# EAGLE schematic Carloop-v2.0 (EAGLE 7.5.0)
DATABASE: /home/monkbroc/Electronics/eagle/PARTSDB.tsv
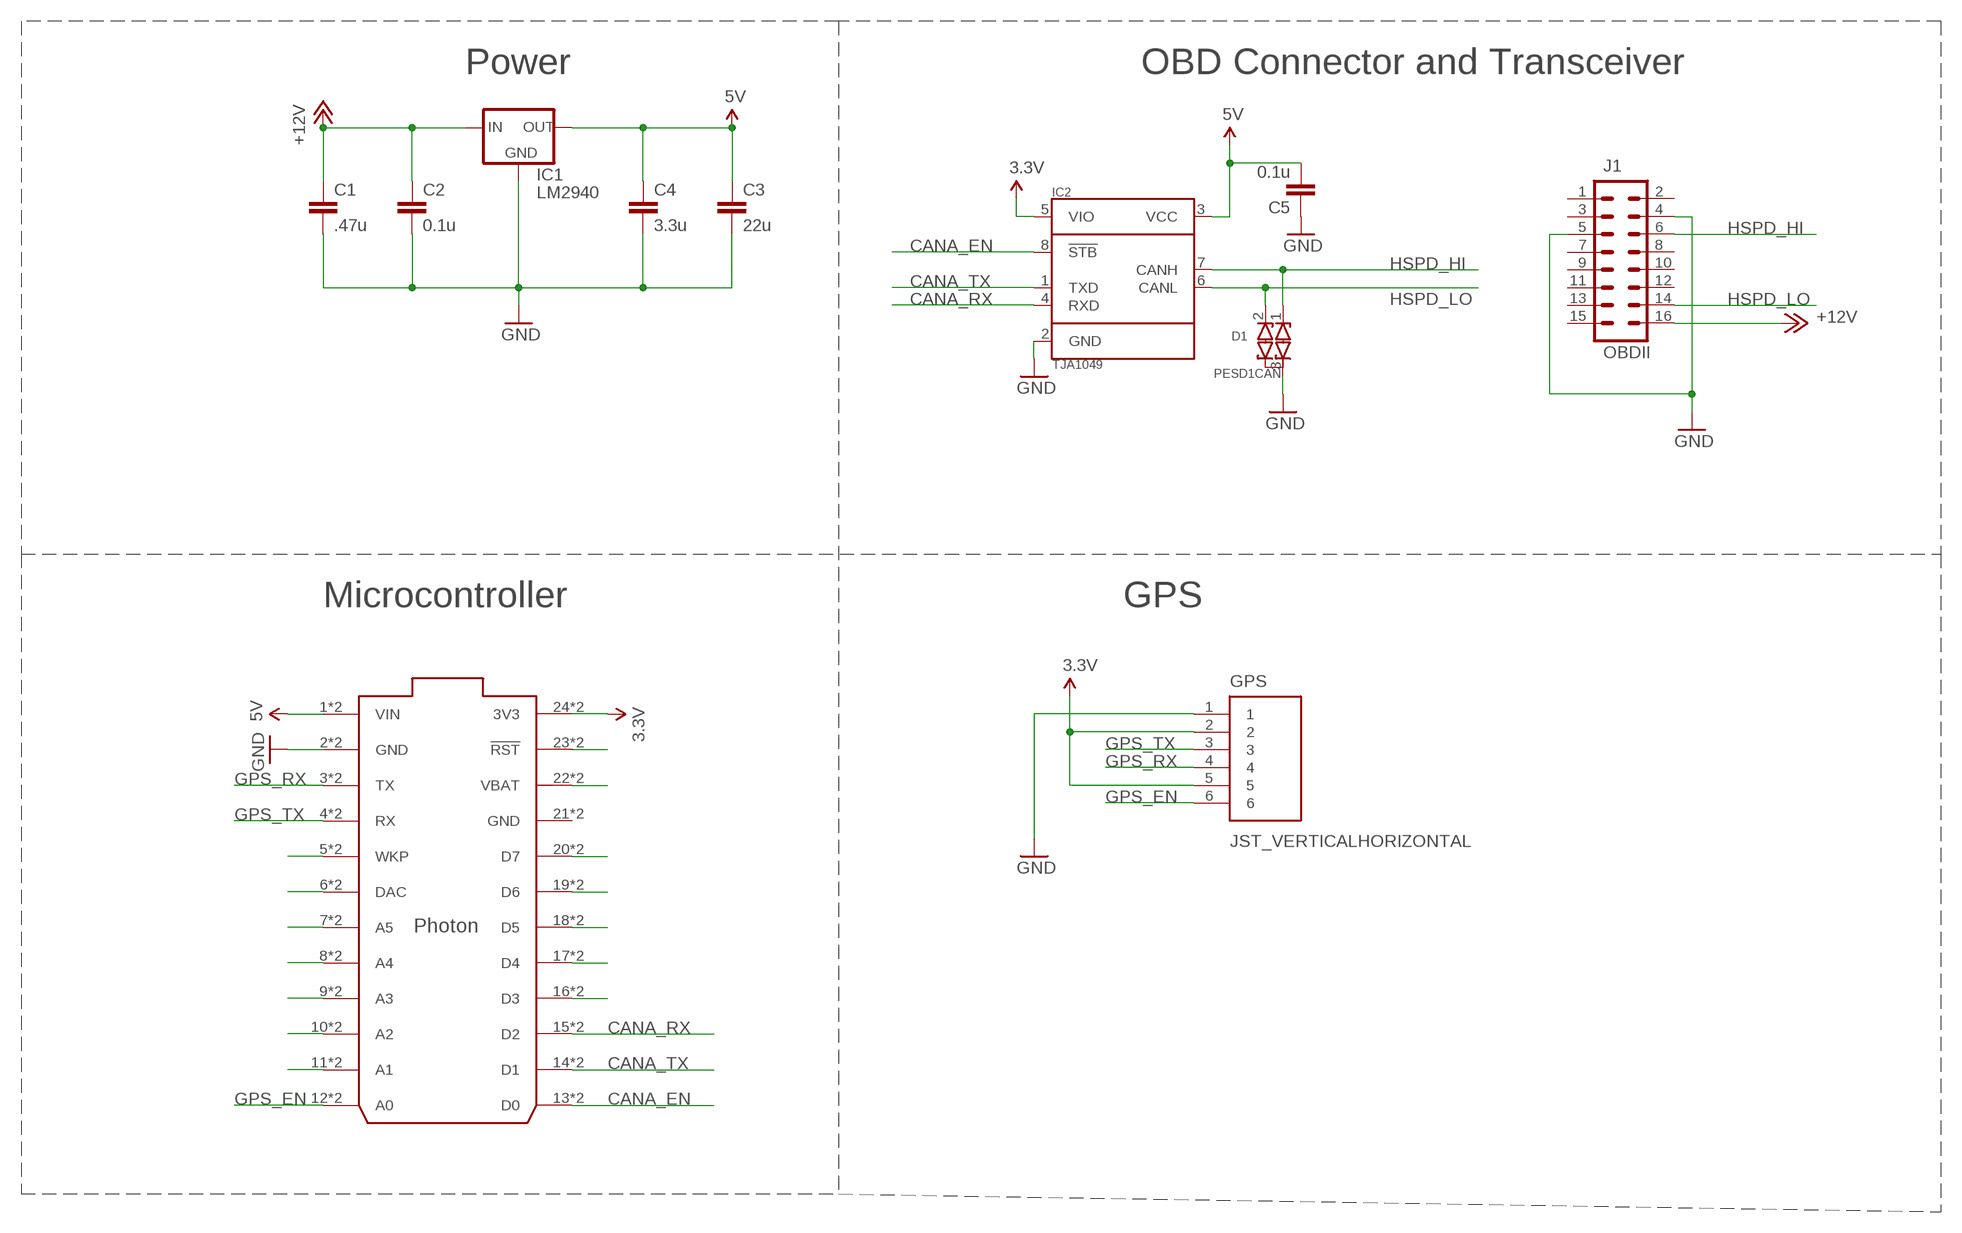
[diagram p0: schematic, sheet 1]

## Parts
C1  .47u  C-EUC0805  [C0805]
C2  0.1u  C-EUC0805  [C0805]
C3  22u  C-EUC0805  [C0805]
C4  3.3u  C-EUC0805  [C0805]
C5  0.1u  C-EUC0805  [C0805]
CORE  PHOTONWITH_EXTERNAL_HEADERS  [PHOTON_STACKABLE_EXTERNAL]
D1  PESD1CAN  DIODE_ESD_DUAL-SOT-23  [SOT23]
GPS  JST_VERTICALHORIZONTAL  [JST-6-SMD-HOR-1.0MM]
IC1  LM2940  [SOT223]
IC2  TJA1049  [SO8]
J1  OBDII  M08X2STRAIGHT  [OBDII-STRAIGHT]

## Nets
3.3V: CORE.24(3V3) CORE.@24(3V3) GPS.2 GPS.5 IC2.5(VIO)
5V: C3.1 C4.1 C5.2 CORE.1(VIN) CORE.@1(VIN) IC1.3(OUT) IC2.3(VCC)
+12V: C1.1 C2.1 IC1.1(IN) J1.16
CANA_EN: CORE.13(D0) CORE.@13(D0) IC2.8(!STB)
CANA_RX: CORE.15(D2) CORE.@15(D2) IC2.4(RXD)
CANA_TX: CORE.14(D1) CORE.@14(D1) IC2.1(TXD)
GND: C1.2 C2.2 C3.2 C4.2 C5.1 CORE.2(GND) CORE.@2(GND) D1.3(COM) GPS.1 IC1.2(GND) IC1.4(GND) IC2.2(GND) J1.4 J1.5
GPS_EN: CORE.12(A0) CORE.@12(A0) GPS.6
GPS_RX: CORE.3(TX) CORE.@3(TX) GPS.4
GPS_TX: CORE.4(RX) CORE.@4(RX) GPS.3
HSPD_HI: D1.1(C1) IC2.7(CANH) J1.6
HSPD_LO: D1.2(C2) IC2.6(CANL) J1.14
N$10: CORE.23(!RST) CORE.@23(!RST)
N$11: CORE.22(VBAT) CORE.@22(VBAT)
N$12: CORE.20(D7) CORE.@20(D7)
N$13: CORE.19(D6) CORE.@19(D6)
N$14: CORE.18(D5) CORE.@18(D5)
N$15: CORE.17(D4) CORE.@17(D4)
N$16: CORE.16(D3) CORE.@16(D3)
N$18: CORE.11(A1) CORE.@11(A1)
N$19: CORE.10(A2) CORE.@10(A2)
N$20: CORE.9(A3) CORE.@9(A3)
N$23: CORE.8(A4) CORE.@8(A4)
N$24: CORE.7(A5) CORE.@7(A5)
N$25: CORE.6(DAC) CORE.@6(DAC)
N$26: CORE.5(WKP) CORE.@5(WKP)
Unconnected: J1.1 J1.2 J1.3 J1.7 J1.8 J1.9 J1.10 J1.11 J1.12 J1.13 J1.15

## Notes on the sheet
- Power | OBD Connector and Transceiver
- Microcontroller | GPS

## Power pins joined to a net without a drawn wire
GND: CORE.21(GND) CORE.@21(GND)

## Library data of the parts
C1 = rcl:C-EU: CAPACITOR, European symbol; PARTNO: C0805C474K5RACTU
C2 C5 = rcl:C-EU: CAPACITOR, European symbol; PARTNO: 08055C104KAT2A
C3 = rcl:C-EU: CAPACITOR, European symbol; PARTNO: GRM219R61A226MEA0D
C4 = rcl:C-EU: CAPACITOR, European symbol; PARTNO: C0805C335K8PACTU
CORE = MuniRent:PHOTON; PARTNO: PPPC122LFBN-RC
D1 = MuniRent:DIODE_ESD_DUAL: Dual ESD Diode, with a common anode; PARTNO: PESD1CAN-215
GPS = MuniRent:JST_VERTICAL; PARTNO: JST-6-HOR
IC1 = MuniRent:LM2940; PARTNO: LM2940IMP-5.0/NOPB
IC2 = MuniRent:TJA1049; PARTNO: TJA1049T-118
J1 = MuniRent:M08X2: .1" headers, two rows of 8 each; PARTNO: OBD-II